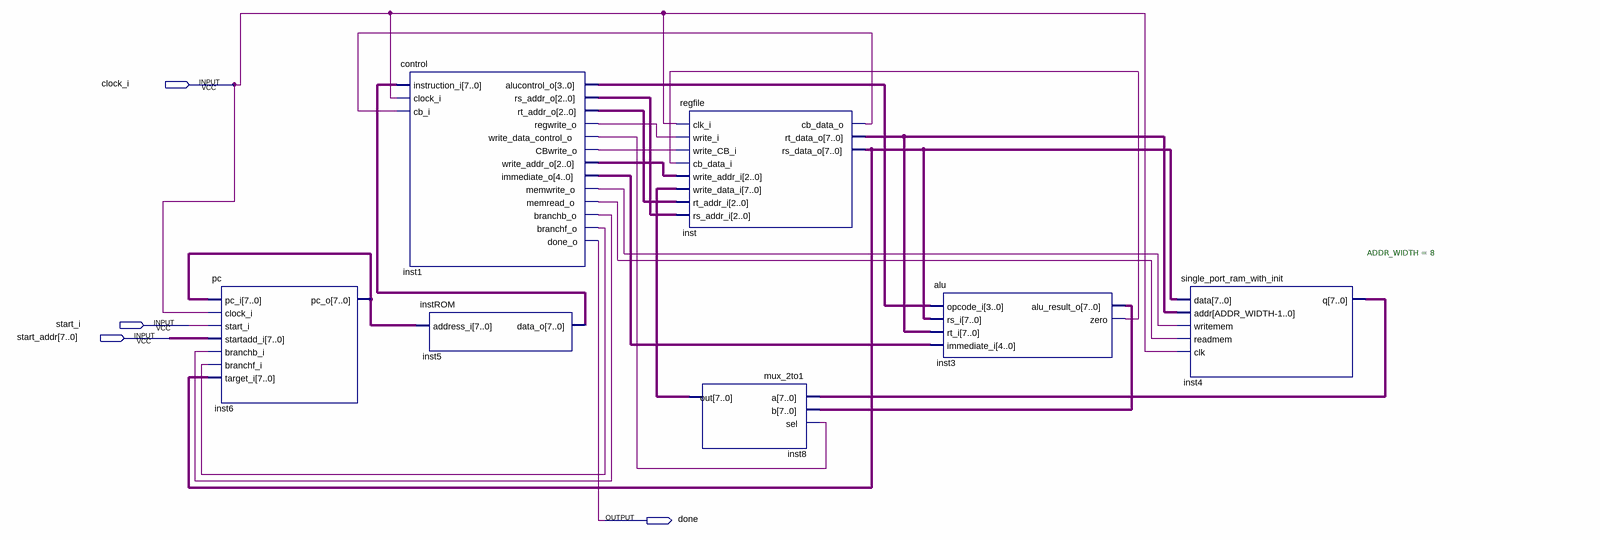
[diagram p0: schematic sheet]
// Quartus schematic lab3.bdf as structural Verilog: 7 symbols, 4 pins
module lab3 (
  input  clock_i,
  input  start_i,
  input  [7:0] start_addr,
  output done
);

  wire inst1_branchb_o, inst1_branchf_o, inst1_cbwrite_o, inst1_memread_o, inst1_memwrite_o,
       inst1_regwrite_o, inst1_write_data_control_o, inst3_zero, inst_cb_data_o;
  wire [2:0] inst1_rs_addr_o, inst1_rt_addr_o, inst1_write_addr_o;
  wire [3:0] inst1_alucontrol_o;
  wire [4:0] inst1_immediate_o;
  wire [7:0] inst3_alu_result_o, inst4_q, inst5_data_o, inst6_pc_o, inst8_out, inst_rs_data_o, inst_rt_data_o;

  pc inst6 (
    .pc_i(inst6_pc_o), .clock_i(clock_i), .start_i(start_i), .startadd_i(start_addr),
    .branchb_i(inst1_branchb_o), .branchf_i(inst1_branchf_o), .target_i(inst_rs_data_o), .pc_o(inst6_pc_o));
  control inst1 (
    .instruction_i(inst5_data_o), .clock_i(clock_i), .cb_i(inst_cb_data_o),
    .alucontrol_o(inst1_alucontrol_o), .rs_addr_o(inst1_rs_addr_o), .rt_addr_o(inst1_rt_addr_o),
    .regwrite_o(inst1_regwrite_o), .write_data_control_o(inst1_write_data_control_o),
    .CBwrite_o(inst1_cbwrite_o), .write_addr_o(inst1_write_addr_o), .immediate_o(inst1_immediate_o),
    .memwrite_o(inst1_memwrite_o), .memread_o(inst1_memread_o), .branchb_o(inst1_branchb_o),
    .branchf_o(inst1_branchf_o), .done_o(done));
  instROM inst5 (.address_i(inst6_pc_o), .data_o(inst5_data_o));
  regfile inst (
    .clk_i(clock_i), .write_i(inst1_regwrite_o), .write_CB_i(inst1_cbwrite_o), .cb_data_i(inst3_zero),
    .write_addr_i(inst1_write_addr_o), .write_data_i(inst8_out), .rt_addr_i(inst1_rt_addr_o),
    .rs_addr_i(inst1_rs_addr_o), .cb_data_o(inst_cb_data_o), .rt_data_o(inst_rt_data_o),
    .rs_data_o(inst_rs_data_o));
  mux_2to1 inst8 (.a(inst4_q), .b(inst3_alu_result_o), .sel(inst1_write_data_control_o), .out(inst8_out));
  alu inst3 (
    .opcode_i(inst1_alucontrol_o), .rs_i(inst_rs_data_o), .rt_i(inst_rt_data_o),
    .immediate_i(inst1_immediate_o), .alu_result_o(inst3_alu_result_o), .zero(inst3_zero));
  single_port_ram_with_init #(.ADDR_WIDTH(8)) inst4 (
    .data(inst_rs_data_o), .addr(inst_rt_data_o), .writemem(inst1_memwrite_o), .readmem(inst1_memread_o),
    .clk(clock_i), .q(inst4_q));
endmodule
